# Altium schematic sheet Base.SchDoc: Cam_Base
size A4
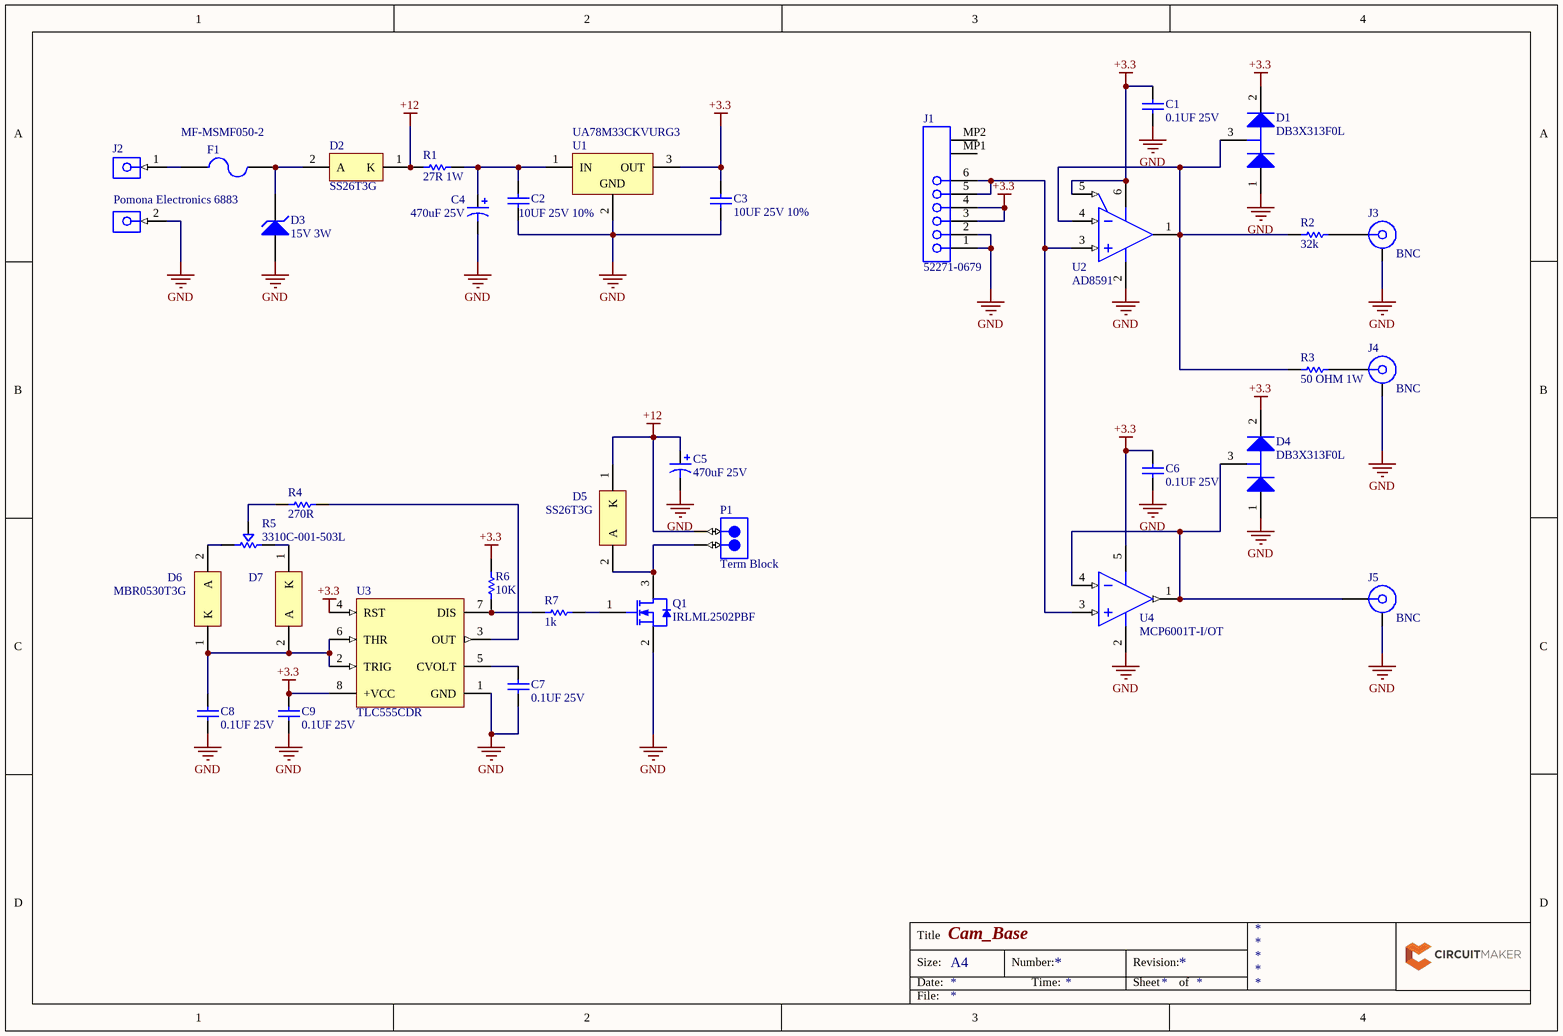
[diagram p0: Base.SchDoc]

## Parts
C1  0.1UF 25V  [CAPC2013X94X50NL20T25]
C2  10UF 25V 10%  [PCB-121631-1]
C3  10UF 25V 10%  [PCB-121631-1]
C4  470uF 25V  [PCB-90356-1]
C5  470uF 25V  [PCB-90356-1]
C6  0.1UF 25V  [CAPC2013X94X50NL20T25]
C7  0.1UF 25V  [CAPC2013X94X50NL20T25]
C8  0.1UF 25V  [CAPC2013X94X50NL20T25]
C9  0.1UF 25V  [CAPC2013X94X50NL20T25]
D1  DB3X313F0L  [PCB-810955-2]
D2  SS26T3G  [ONSC-SMB-2-403A-03_V]
D3  15V 3W  [PCB-19354311-1]
D4  DB3X313F0L  [PCB-810955-2]
D5  SS26T3G  [ONSC-SMB-2-403A-03_V]
D6  MBR0530T3G  [ONSC-SOD-123-2-425-04_V]
D7  MBR0530T3G  [ONSC-SOD-123-2-425-04_V]  (value not drawn)
F1  MF-MSMF050-2  [L1812]
J1  52271-0679  [MOLX-52271-0679]
J2  Pomona Electronics 6883  [PCB-19368571-1]
J3  BNC  [ROS-71K101-400A5_V]
J4  BNC  [ROS-71K101-400A5_V]
J5  BNC  [ROS-71K101-400A5_V]
P1  Term Block  [PCB-751788-1]
Q1  IRLML2502PBF  [SOT-23-NB3_M]
R1  27R 1W  [ROHM-MCR100-2_V]
R2  32k  [RESC3216X60X45NL10T20]
R3  50 OHM 1W  [PCB-1863557-1]
R4  270R  [PCB-1849257-1]
R5  3310C-001-503L  [PCB-1209584-1]
R6  10K  [RESC3216X60X45ML10T20]
R7  1k  [RESC3216X60X45ML10T20]
U1  UA78M33CKVURG3  [PCB-19361514-1]
U2  AD8591  [ADI-RJ-6_N]
U3  TLC555CDR  [PCB-13603382-1]
U4  MCP6001T-I/OT  [SOT-23-OT5_L]

## Nets
+3.3: C1.1 C3.2 C6.1 C9.1 D1.2(K) D4.2(K) J1.3 J1.4 R6.2 U1.3(OUT) U2.5(~{SD}) U2.6(+V) U3.4(RST) U3.8(+VCC) U4.5(VDD)
+12: C5.1 D2.1(K) D5.1(K) P1.1 R1.1
GND: C1.2 C2.1 C3.1 C4.2 C5.2 C6.2 C7.2 C8.2 C9.2 D1.1(A) D3.1(A) D4.1(A) J1.1 J1.2 J2.2(-) J3.MH J4.MH J5.MH Q1.2(S) U1.2(GND) U2.2(-V) U3.1(GND) U4.2(VSS)
NetC2_2: C2.2 C4.1 R1.2 U1.1(IN)
NetC7_1: C7.1 U3.5(CVOLT)
NetC8_1: C8.1 D6.1(K) D7.2(A) U3.2(TRIG) U3.6(THR)
NetD1_3: D1.3(K/A) R2.1 R3.1 U2.1(OUT_A) U2.4(-IN_A)
NetD2_2: D2.2(A) D3.2(K) F1.2
NetD4_3: D4.3(K/A) J5.1 U4.1(VOUT) U4.4(VIN-)
NetD5_2: D5.2(A) P1.2 Q1.3(D)
NetD6_2: D6.2(A) R5.1
NetD7_1: D7.1(K) R5.3
NetF1_1: F1.1 J2.1(+)
NetJ1_5: J1.5 J1.6 U2.3(+IN_A) U4.3(VIN+)
NetJ3_1: J3.1 R2.2
NetJ4_1: J4.1 R3.2
NetQ1_1: Q1.1(G) R7.2
NetR4_1: R4.1 R5.2
NetR4_2: R4.2 U3.3(OUT)
NetR6_1: R6.1 R7.1 U3.7(DIS)

Not connected (* = marked no-connect by the designer): J1 MP1 MP2

## Notes on the sheet
- Title
- Size:
- Date:
- A4
- Number:
- Time:
- Revision:
- Sheet
- of
- File:

## Library data of the parts
C1 C6-C9 = CMP-126070-1: CAP CER 0.1UF 25V Y5V 0805; Manufacturer Part Number: 08053G104ZAT2A; Tolerance (%): -20 to +80 %; CiivaID: 126070; Capacitance: 100 nF; Ciiva URL: https://ciiva.com/part/08053g104zat2a-126070; Dielectric: Y5V; Rated Voltage: 25 V; Case Size/Dimension: 0805
C2 C3 = CMP-121631-1: CAP CER 10UF 25V 10% X5R 1206; Manufacturer Part Number: TMK316BJ106KL-T; Capacitance: 10µF; Dynamic Catalog: M Series, High Dielectric; Kits: 587-1798-KIT-ND- KIT CAP CER HI CAP 1206 & 1210 S; Other Names: 587-1337-1; Catalog Drawings: xMK Series_1206_1.6; Product Change Notification: X5R, X7R Part Number Change; CiivaID: 121631; Size / Dimension: 0.126" L x 0.063" W (3.20mm x 1.60mm); Operating Temperature: -55°C ~ 85°C; Series: M; Voltage - Rated: 25V; Temperature Coefficient: X5R; Family: Ceramic Capacitors; Category: Capacitors; Packaging: Cut Tape (CT); Tolerance: ±10%; Standard Package: 1; Package / Case: 1206 (3216 Metric); Mounting Type: Surface Mount, MLCC; Thickness (Max): 0.071" (1.80mm); Ciiva URL: https://ciiva.com/part/tmk316bj106kl-t-121631; Applications: General Purpose
C4 C5 = CMP-90356-1: CAP ALUM 470UF 25V 20% SMD; Manufacturer Part Number: EMVA250ADA471MJA0G; Other Names: 565-2109-6; CiivaID: 90356; Capacitance: 470µF; Lifetime @ Temp.: 2000 Hrs @ 85°C; Surface Mount Land Size: 0.406" L x 0.406" W (10.30mm x 10.30mm); Catalog Drawings: JA0 BottomJA0_10 x 10; Dynamic Catalog: Alchip™ MVA Series; Ripple Current: 400mA; Height - Seated (Max): 0.394" (10.00mm); Voltage Rating: 25V; Family: Aluminum Capacitors; Packaging: Digi-Reel®; Mounting Type: Surface Mount; Operating Temperature: -40°C ~ 85°C; Features: General Purpose; Ciiva URL: https://ciiva.com/part/emva250ada471mja0g-90356; Standard Package: 1; Tolerance: ±20%; Series: Alchip™ MVA; Package / Case: Radial, Can - SMD; Category: Capacitors; Size / Dimension: 0.394" Dia (10.00mm)
D1 D4 = CMP-810955-1: DIODE SCHOTTKY 30V 200MA; CiivaID: 810955; Manufacturer Part Number: DB3X313F0L
D2 D5 = CMP-4964409-1: Schottky Power Rectifier, 2-Pin SMB, Pb-Free, Tape and Reel; Ciiva URL: https://ciiva.com/part/SS26T3G-4964409; CiivaID: 4964409
D3 = CMP-19354311-7: DIODE ZENER 15V 3W SMB; Manufacturer Part Number: 1SMB5929BT3G; Test Current: 25mA; Zener Type: Voltage Regulator; Speed, Switching: 200 mA; Temperature, Junction, Maximum: +150                                                                    °C; Maximum Zener Impedance: 9O; Forward Voltage: 1.5V; Forward Current: 200mA; Configuration: Single; Maximum Reverse Leakage Current: 1µA; Zener Voltage Tolerance: ±5%; Voltage, Forward: 1.5                                                                    V; Current, Reverse: 25                                                                    mA; Current, Forward: 200                                                                    mA; Time, Recovery: +150 °C; Temperature, Operating: -65 to +150                                                                    °C; Voltage, Reverse: 15                                                                    V; Nominal Zener Voltage: 15V; Operating Temperature Range: -65 to +150°C; Ciiva URL: https://ciiva.com/part/1smb5929bt3g-19354311; Mounting Type: Surface Mount; Capacitance, Junction: 3 W; Maximum Operating Temperature: +150°C; CiivaID: 19354311; Power Dissipation: 3W; Package Type: Case 403A; Primary Type: Zener; Minimum Operating Temperature: -65°C; Dimensions: 4.60 x 3.95 x 2.28mm; Pin Count: 2; Height: 2.28mm; Length: 4.6mm; Width: 3.95mm
D6 D7 = CMP-822415-1: Schottky Power Rectifier, 2-Pin SOD-123, Pb-Free, Tape and Reel; CiivaID: 822415; Voltage - Forward (Vf) (Max) @ If: 430mV @ 500mA; Other Names: MBR0530T3GOSDKR; Current - Reverse Leakage @ Vr: 130µA @ 30V; Speed: Fast Recovery =200mA (Io); Current - Average Rectified (Io): 500mA; Voltage - DC Reverse (Vr) (Max): 30V; Product Change Notification: Wire Change 08/Jun/2009; Supplier Device Package: SOD-123; Category: Discrete Semiconductor Products; Packaging: Digi-Reel®; Family: Diodes, Rectifiers - Single; Standard Package: 1; Diode Type: Schottky; Package / Case: SOD-123; Ciiva URL: https://ciiva.com/part/MBR0530T3G-822415; Dynamic Catalog: Schottky; Mounting Type: Surface Mount
F1 = CMP-277735-3: PTC RESETTABLE .50A 15V 1812; Manufacturer: Bourns; Hold Current: 0.5 A; Trip Current: 1 A; Resistance: 150 mOhms; Maximum Voltage: 15 VDC; Type: PTC Resettable Fuses; CiivaID: 277735; Current Rating: 100 A; Factory Pack Quantity: 2000; Series: MF-MSMF; Manufacturer Part Number: MF-MSMF050-2; Product Category: Resettable Fuses - PPTC; Operating Temperature Range: - 40 C to + 85 C; Maximum Voltage DC: 15 V; Dimensions: 4.73 mm L x 3.41 mm W x 0.85 mm  H; Mounting Style: SMD/SMT; Termination Style: SMD/SMT; Tradename: Multifuse; Packaging: Reel; Ciiva URL: https://ciiva.com/part/mf-msmf050-2-277735; Package / Case: 1812 (4532 metric); RoHS: Details; Current Rating (Max): 100 A; Brand: Bourns; Current Rating - Max: 100 A
J1 = CMP-605082-2: 1.0 mm Pitch Easy-On(TM) Type FPC Connector, 3.0 mm Mated Height, Right Angle, ZIF, SMT, Bottom Contact, 6 Circuits, -40 to 85 degC, ELV and RoHS Compliant, Tape and Reel; Contact Resistance: 0.02 Ω; Current Rating: 0.5 A; Gender: Female; Insulation Resistance: 100000000.0 Ω; Number of Circuits: 6; Number of Mating Cycles: 30; Pin Pitch: 0.001 m; Voltage Rating (DC): 50.0 V; Contact Material: Phosphor Bronze; ELV Compliant: Compliant; Flammability Rating: UL 94 V-0; Halogen Free Status: Not Low Halogen; Housing Material: Thermoplastic; Lifecycle Status: Active; Material: Nylon; Mounting Style: Surface Mount; Number of Contacts: 6; Number of Positions: 6; Number of Rows: 1; Octopart Url: https://octopart.com/52271-0679-molex-239622; OctopartID: 7cb9b5b0f1d9a37e; Orientation: Right Angle; Packaging: Tape & Reel (TR); REACH SVHC Compliance: No SVHC; RoHS: Compliant
J2 = CMP-19368571-1: DUAL BINDING POSTS; Manufacturer Part Number: 6883; Part # Aliases: 2125957; Insulation: Insulated; Voltage Rating: 500 V; Current Rating: 30 A; Equipment Type: Binding Posts; CiivaID: 19368571; Contact Plating: Nickel; Factory Pack Quantity: 5; Length: 1.983 in; Color: Red; Brand: Pomona Electronics; Product Category: Test Plugs & Test Jacks; Operating Temperature: + 70 C; Insulation Material: Nylon; Manufacturer: Pomona; Type: Double binding post with raised base; Ciiva URL: https://ciiva.com/part/6883-19368571; Contact Material: Brass; RoHS: Details
J3-J5 = CMP-5779173-A.1: BNC5 STRAIGHT CABLE JACK; Manufacturer Part Number: BNC5-J-P-GN-ST-TH2D; Ciiva URL: https://ciiva.com/part/bnc5-j-p-gn-st-th2d-5779173; CiivaID: 5779173
P1 = CMP-751788-14: CONN TERM BLOCK 2POS 5.08MM PCB; Manufacturer Part Number: 1729128; Part # Aliases: MKDSN_1,5/_2-5,08 MKDSN152508; Current Rating: 13.5 A; CiivaID: 751788; Wire Gauge Min: 26; Wire Gauge Max: 16; Brand: Phoenix Contact; Number of Positions: 2; Wire Orientation: Straight; Unit Weight: 1 oz; Voltage Rating: 400 V; Connection Method: Screw; Wire Gauge Range: 26-16; Product Category: Fixed Terminal Blocks; Pitch: 5.08 mm; Series: MKDSN; Product: Fixed Terminal Blocks; Mounting Style: Through Hole; Manufacturer: Phoenix Contact; Factory Pack Quantity: 50; Tradename: COMBICON Control; Number of Positions / Contacts: 2; RoHS: Details; Flammability Rating: UL 94 V-0; Ciiva URL: https://ciiva.com/part/1729128-751788; Mounting Angle: Straight; Termination Style: Through Hole; Type: Wire to Board
Q1 = CMP-2602693-1: MOSFET MOSFT 20V 4.2A 45mOhm 8nC Log Lvl; Manufacturer Part Number: IRLML2502TRPBF; Channel Type: N-Channel; Rated Power Dissipation: 1.25 W; Drain-Source On Resistance-Max: 0.045 O; Qg Gate Charge: 8 nC; CiivaID: 2602693; Drain-to-Source Voltage [Vdss]: 20 V; Ciiva URL: https://ciiva.com/part/irlml2502trpbf-2602693
R1 = CMP-1861555-1: RES SMD 27 OHM 5% 1W 2512; Manufacturer: Vishay; Manufacturer Part Number: CRCW251227R0JNEG; Voltage Rating: 500 V; Temperature Coefficient: 200 PPM / K; Resistance: 27 Ohms; Case Height: 0.6 mm; Case Length: 6.3 mm; Case Width: 3.15 mm; Unit Weight: 0.001429 oz; Brand: Vishay / Dale; Factory Pack Quantity: 2000; Case Code - in: 2512; Ciiva URL: https://ciiva.com/part/crcw251227r0jneg-1861555; Dimensions: 3.15 mm W x 6.3 mm L x 0.6 mm H; Case Code - mm: 6432; Termination Style: SMD/SMT; Power Rating: 1 W; Tolerance: 5 %; Packaging: Reel; Operating Temperature Range: - 55 C to + 155 C; Series: CRCW; Product: Thick Film Resistors SMD; RoHS: Details; Product Category: Thick Film Resistors - SMD; Package / Case: 2512 (6432 metric); CiivaID: 1861555
R2 = CMP-1867887-1: RES SMD 332K OHM 1% 1/4W 1206; Manufacturer: Vishay; Manufacturer Part Number: CRCW1206332KFKEA; Case Height: 0.55 mm; Temperature Coefficient: 100 PPM / K; Power Rating: 250 mW (1/4 W); Brand: Vishay / Dale; Unit Weight: 0.000353 oz; Resistance: 332 kOhms; Case Length: 3.2 mm; Voltage Rating: 200 V; Case Width: 1.6 mm; Product: Thick Film Resistors SMD; Dimensions: 1.6 mm W x 3.2 mm L x 0.55 mm H; Series: CRCW; Case Code - in: 1206; Packaging: Reel; Tolerance: 1 %; Product Category: Thick Film Resistors - SMD; Case Code - mm: 3216; Ciiva URL: https://ciiva.com/part/crcw1206332kfkea-1867887; Factory Pack Quantity: 5000; RoHS: Details; Package / Case: 1206 (3216 metric); Termination Style: SMD/SMT; CiivaID: 1867887; Operating Temperature Range: - 55 C to + 155 C
R3 = CMP-1863557-1: RES SMD 50 OHM 1% 1W 2515; Manufacturer Part Number: WSC251550R00FEA; Product Range: VISHAY - WSC Series; External Depth: 2.79mm; External Width: 3.81mm; External Length / Height: 6.35mm; Temperature Coefficient: ± 20ppm/°C; No. of Pins: 2; Voltage Rating: 7.1V; SVHC: To Be Advised; Dielectric Strength VAC: 500V; Resistor Element Material: Wirewound; Resistor Case Style: 2515 [6438 Metric]; Resistance: 50ohm; Package / Case: 2515; Operating Temperature Max: 275°C; Series: WSC; Power Rating: 1W; Packaging: Cut Tape; MSL: MSL 1 - Unlimited; Resistor Mounting: SMD; CiivaID: 1863557; Operating Temperature Range: -65°C to +275°C; Ciiva URL: https://ciiva.com/part/wsc251550r00fea-1863557; Resistor Element Type: Wirewound; Resistance Tolerance: ± 1%; Operating Temperature Min: -65°C
R4 = CMP-1849257-1: RESISTOR, 1206, 0.25W, 1%, 270R; Manufacturer Part Number: ERJ-8ENF2700V; Manufacturer: Panasonic; Lead Finish: Tin; Case Style: Molded; Resistance Value: 270 Ohm; Rad Hard: No; Temperature Coefficient: ±100 ppm/°C; Power Rating: 1/4 W; Case Size: 1206; Tolerance: 1 %; CiivaID: 1849257; Operating Temperature: -55 to 155 °C; Type: Thick Film; Category: Resistor Fixed Single-Surface Mount; Packaging: Tape & Reel; Ciiva URL: https://ciiva.com/part/erj-8enf2700v-1849257
R5 = CMP-1209584-1: POT 50K OHM 9MM SQ RTANG PLAST; Product Change Notification: Plastic Change 24/Jun/20113310 Series Epoxy Change 22/Dec/2011; Catalog Drawings: 3310C Series Side 13310C Series Side 2; Power (Watts): 0.25W, 1/4W; Tolerance: ±20%; Temperature Coefficient: ±1000ppm/°C; Number of Turns: Single; Rotation: 300°; Adjustment Type: Side Adjustment; Resistive Material: Conductive Plastic; Actuator Length: 0.500" (12.70mm); Actuator Type: Slotted Shaft; Actuator Diameter: 0.125" (3.18mm); Dynamic Catalog: 3310 Series; Manufacturer Part Number: 3310C-001-503L; Ciiva URL: https://ciiva.com/part/3310c-001-503l-1209584; RoHS Information: 3310C-L Material Declaration; Standard Package: 50; Category: Potentiometers, Variable Resistors; Family: Rotary Potentiometers - Linear; Series: 3310; Resistance (Ohms): 50k; Termination Style: PCB Pins; Size - Body: Square - 0.375" x 0.375" Face x 0.204" L (9.53mm x 9.53mm x 5.18mm); Mounting Type: Through Hole; Packaging: Bulk; CiivaID: 1209584
R6 = CMP-3656780-1: Thick Film Resistors - SMD 1/4watt 10Kohms 5%; Manufacturer Part Number: CRCW120610K0JNEB; Manufacturer: Vishay; Brand: Vishay / Dale; Case Height: 0.55 mm; Unit Weight: 0.000353 oz; Case Width: 1.6 mm; Power Rating: 250 mW (1/4 W); Voltage Rating: 200 V; Temperature Coefficient: 200 PPM / K; Case Length: 3.2 mm; RoHS: Details; Operating Temperature Range: - 55 C to + 155 C; Product: Thick Film Resistors SMD; Case Code - in: 1206; Tolerance: 5 %; Ciiva URL: https://ciiva.com/part/crcw120610k0jneb-3656780; Factory Pack Quantity: 10000; Series: CRCW; Resistance: 10 kOhms; Packaging: Reel; Case Code - mm: 3216; CiivaID: 3656780; Package / Case: 1206 (3216 metric); Product Category: Thick Film Resistors - SMD
R7 = CMP-1858076-1: Res Thick Film 1206 1K Ohm 5% 0.25W(1/4W) ±200ppm/C Molded SMD Automotive Paper T/R; Manufacturer: Vishay; Manufacturer Part Number: CRCW12061K00JNEA; Temperature Coefficient: 200 PPM / K; Case Width: 1.6 mm; Case Length: 3.2 mm; Power Rating: 250 mW (1/4 W); Case Height: 0.55 mm; Resistance: 1 kOhms; Voltage Rating: 200 V; Brand: Vishay / Dale; Unit Weight: 0.000353 oz; Product: Thick Film Resistors SMD; Case Code - mm: 3216; Operating Temperature Range: - 55 C to + 155 C; Packaging: Reel; Case Code - in: 1206; CiivaID: 1858076; Termination Style: SMD/SMT; Product Category: Thick Film Resistors - SMD; Package / Case: 1206 (3216 metric); Ciiva URL: https://ciiva.com/part/crcw12061k00jnea-1858076; Series: CRCW; Tolerance: 5 %; Dimensions: 1.6 mm W x 3.2 mm L x 0.55 mm H; Factory Pack Quantity: 5000; RoHS: Details
U1 = CMP-19361514-3: TEXAS INSTRUMENTS   UA78M33CKVURG3   VOLT REG, 3.3V, TO-252; Line Regulation: 100 mV; PSRR / Ripple Rejection (Typ): 80 dB; Input Voltage MAX: 25 V; Output Current: 0.5 A; Unit Weight: 0.011598 oz; Output Type: Fixed; Polarity: Positive; Number of Outputs: 1; Input Voltage MIN: 5.3 V; CiivaID: 19361514; Packaging: Reel; Package / Case: TO-252-3; Ciiva URL: https://ciiva.com/part/ua78m33ckvurg3-19361514; Factory Pack Quantity: 2500; Series: UA78M33; Mounting Style: SMD/SMT; Output Voltage: 3.3 V; Product Category: Linear Voltage Regulators; Load Regulation: 100 mV; Minimum Operating Temperature: 0 C; Maximum Operating Temperature: + 125 C; Manufacturer Part Number: UA78M33CKVURG3; PSRR / Ripple Rejection - Typ: 80 dB; Brand: Texas Instruments; Manufacturer: Texas Instruments; RoHS: Details
U2 = CMP-1324845-1: Single Channel Wide Bandwidth Operational Amplifier, 5 MHz BW, 3.5 V/us SR, Industrial, 6-pin SOT23 (RJ-6), Reel; Manufacturer: Analog Devices; Shut Down Feature: Yes; Dual Supply Voltage (Typ): Not RequiredV; Input Offset Voltage: 25mV; Unity Gain Bandwidth Product: 3MHz; Single Supply Voltage (Min): 2.5V; Rail/Rail I/O Type: Rail to Rail Input/Output; Slew Rate: 5V/us; Single Supply Voltage (Typ): 3/5V; Power Supply Rejection Ratio: 45dB; Input Bias Current: 50pA; Number of  Elements: 1; Common Mode Rejection Ratio: 38dB; Voltage Gain in dB: 89.54dB; Single Supply Voltage (Max): 6V; CiivaID: 1324845; Ciiva URL: https://ciiva.com/part/ad8591artz-reel-1324845; Pin Count: 6; Power Supply Requirement: Single; Mounting: Surface Mount; Operating Temperature Classification: Industrial; Packaging: Tape and Reel; Type: General Purpose Amplifier; Dual Supply Voltage (Min): Not RequiredV; Package Type: SOT-23; Technology: CMOS; Operating Temp Range: -40C to 85C; Dual Supply Voltage (Max): Not RequiredV
U3 = CMP-13603382-1: IC, TIMER, SMD, SOIC8, 555; No. of Pins: 8; Supply Voltage Range: 2V to 15V; Clock External Input: No; No. of Timers: 1; Supply Voltage Min: 2V; IC Temperature Range: Commercial; Operating Mode: Astable; Supply Voltage Max: 15V; SVHC: No SVHC (20-Jun-2013); Base Number: 555; Digital IC Case Style: SOIC; Operating Frequency Max: 2.1MHz; Operating Temperature Max: 70°C; Manufacturer Part Number: TLC555CDR; Ciiva URL: https://ciiva.com/part/tlc555cdr-13603382; CiivaID: 13603382; Termination Type: SMD; No. of Channels: 1; Operating Temperature Min: 0°C; Operating Temperature Range: 0°C to +70°C; IC Generic Number: 555; Package / Case: SOIC; Frequency: 2.1MHz
U4 = CMP-1319525-2: 1 MHz, Low-Power Operational Amplifier, 5-Pin SOT-23, Industrial Temperature, Tape and Reel; Op Amp Type: General Purpose; Base Number: 6001; Gain Bandwidth: 1MHz; Supply Voltage Range: 1.8V to 5.5V; Input Offset Voltage Max: 7mV; Slew Rate: 0.6V/µs; Operational Amplifier Features: Rail-to-Rail Op Amp; Current Iqc Max: 170µA; SVHC: No SVHC (19-Dec-2012); No. of Pins: 5; Supply Voltage Max: 5.5V; I/O Type: Rail-Rail I/O; Supply Voltage Min: 1.8V; Input Offset Drift Max: 2µV/°C; No. of Amplifiers: 1; Current Iqc Typ: 100mA; Amplifier Type: CMOS; Bandwidth: 1MHz; Operating Temperature Max: 85°C; CiivaID: 1319525; Logic Function Number: 6001; Operating Temperature Min: -40°C; Package / Case: SOT-23; Device Marking: MCP6001T-I/OT; Ciiva URL: https://ciiva.com/part/MCP6001T-I/OT-1319525; Supply Voltage + Nom: 5.5V; Operating Temperature Range: -40°C to +85°C; Amplifier Case Style: SOT-23; IC Generic Number: 6001